# EAGLE design TSOC_Teensy3X (EAGLE 6.6.0)
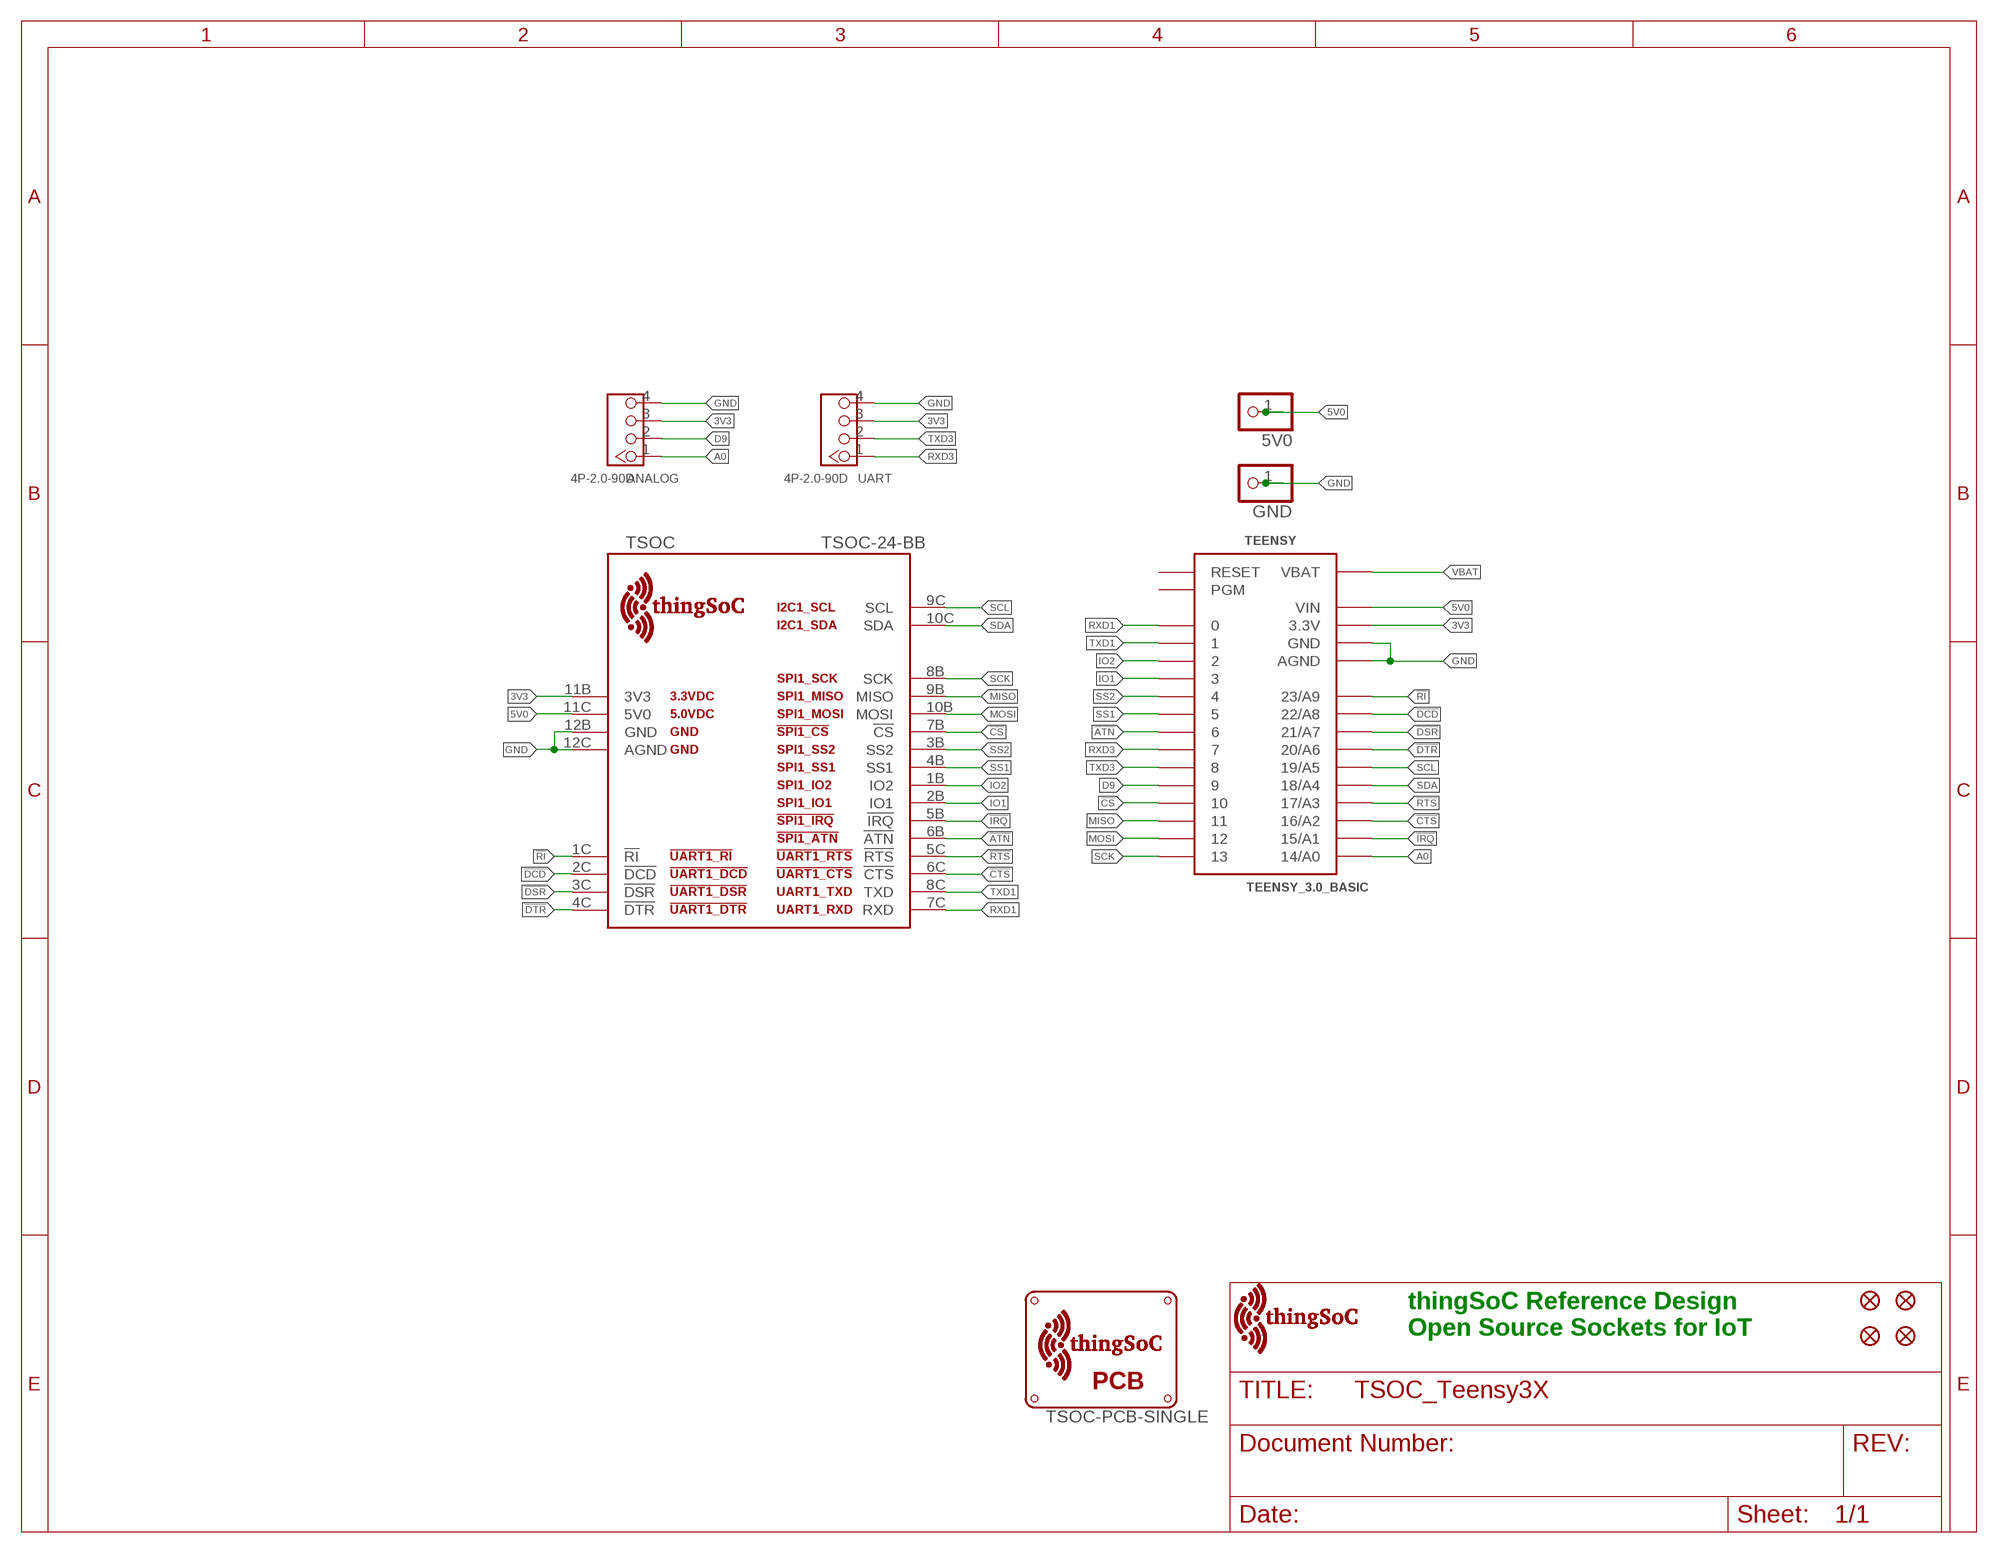
[diagram p0: schematic, sheet 1]

## Parts
5V0  WPAD-1-PTH  [WPAD-1-PTH-2.54]
ANALOG  4P-2.0-90D  GROVE-CONNECTOR-DIP-90D(4P-2.0)  [HW4-2.0-90D]
FID1  FIDUCIALUFIDUCIAL  [MICRO-FIDUCIAL]
FID2  FIDUCIALUFIDUCIAL  [MICRO-FIDUCIAL]
FID3  FIDUCIALUFIDUCIAL  [MICRO-FIDUCIAL]
FID4  FIDUCIALUFIDUCIAL  [MICRO-FIDUCIAL]
GND  WPAD-1-PTH  [WPAD-1-PTH-2.54]
TEENSY  TEENSY_3.0_BASIC  [TEENSY_3.0_BASIC]
TSOC  TSOC-24-BB  [TSOC-BB-S24]
U$2  TSOC-PCB-SINGLE  [TSOC-BB-BRD-DIM]
U$5  TSOC-LOGO-LRG  [TSOC-LOGO-LRG]
UART  4P-2.0-90D  GROVE-CONNECTOR-DIP-90D(4P-2.0)  [HW4-2.0-90D]

## Nets
3V3: ANALOG.3 TEENSY.3.3V TEENSY.3.3V1(3.3V) TSOC.11B(3V3) UART.3
5V0: 5V0.1 TEENSY.VIN TSOC.11C(5V0)
!ATN: TEENSY.6 TSOC.6B(!ATN)
!CS: TEENSY.10 TSOC.7B(!CS)
!CTS: TEENSY.16/A2 TSOC.6C(!CTS)
!DCD: TEENSY.22/A8 TSOC.2C(!DCD)
!DSR: TEENSY.21/A7 TSOC.3C(!DSR)
!DTR: TEENSY.20/A6 TSOC.4C(!DTR)
!IRQ: TEENSY.15/A1 TSOC.5B(!IRQ)
!RI: TEENSY.23/A9 TSOC.1C(!RI)
!RTS: TEENSY.17/A3 TSOC.5C(!RTS)
A0: ANALOG.1 TEENSY.14/A0
D9: ANALOG.2 TEENSY.9
GND: ANALOG.4 GND.1 TEENSY.AGND TEENSY.GND TEENSY.GND1(GND) TSOC.12B(GND) TSOC.12C(AGND) UART.4
IO1: TEENSY.3 TSOC.2B(IO1)
IO2: TEENSY.2 TSOC.1B(IO2)
MISO: TEENSY.11 TSOC.9B(MISO)
MOSI: TEENSY.12 TSOC.10B(MOSI)
RXD1: TEENSY.0 TSOC.7C(RXD)
RXD3: TEENSY.7 UART.1
SCK: TEENSY.13 TSOC.8B(SCK)
SCL: TEENSY.19/A5 TSOC.9C(SCL)
SDA: TEENSY.18/A4 TSOC.10C(SDA)
SS1: TEENSY.5 TSOC.4B(SS1)
SS2: TEENSY.4 TSOC.3B(SS2)
TXD1: TEENSY.1 TSOC.8C(TXD)
TXD3: TEENSY.8 UART.2
VBAT: TEENSY.VBAT
Unconnected: TEENSY.PGM TEENSY.RESET

## Notes on the sheet
- thingSoC Reference Design
  Open Source Sockets for IoT

## Library data of the parts
5V0 GND = PatternAgents-ProtoPads:WPAD-1: Wire Pad - Single Good for scope lead clips, test jumpers, probe points, etc. PatternAgents ProtoPads Library Schematic and PCB layout libraries for design patterns by PatternAgents. For the CADSoft Eagle CAD program : http://www.cadsoftusa.com/download-eagle/ Source LBR : http://www.patternagents.com Github : https://github.com/PatternAgents License : http://creativecommons.org/licenses/by-sa/4.0/ (Creative Commons 4.0) THIS SOFTWARE IS PROVIDED BY THE CONTRIBUTORS "AS IS" AND WITHOUT ANY EXPRESS OR IMPLIED WARRANTIES, INCLUDING, BUT NOT LIMITED TO, THE IMPLIED WARRANTIES OF MERCHANTABILITY AND FITNESS FOR A PARTICULAR PURPOSE ARE DISCLAIMED. IN NO EVENT SHALL THE COPYRIGHT OWNER OR CONTRIBUTORS BE LIABLE FOR ANY DIRECT, INDIRECT, INCIDENTAL, SPECIAL, EXEMPLARY, OR CONSEQUENTIAL DAMAGES (INCLUDING, BUT NOT LIMITED TO, PROCUREMENT OF SUBSTITUTE GOODS OR SERVICES; LOSS OF USE, DATA, OR PROFITS; OR BUSINESS INTERRUPTION) HOWEVER CAUSED AND ON ANY THEORY OF LIABILITY, WHETHER IN CONTRACT, STRICT LIABILITY, OR TORT (INCLUDING NEGLIGENCE OR OTHERWISE) ARISING IN ANY WAY OUT OF THE USE OF THIS SOFTWARE, EVEN IF ADVISED OF THE POSSIBILITY OF SUCH DAMAGE.; BOM: EXCLUDE
ANALOG UART = Seeed-Connector -2016:GROVE-CONNECTOR-DIP-90D(4P-2.0): 320110034
FID1-FID4 = TSOC-ESP8266-BASE:FIDUCIAL: Fiducial Alignment Points Various fiducial points for machine vision alignment.
TEENSY = Teensy3.0:TEENSY_3.0_BASIC: Basic Teensy 3.0 with none of the 'inner' pins enabled. See '+4', 'AllAnalogPins", and 'AllPins' packages for additional pin holes, as needed.
TSOC = thingSoC:TSOC-24: thingSoC Twenty-Four(24) Pin Socket Source LBR : http://www.thingsoc.com Github : https://github.com/thingsoc License : http://creativecommons.org/licenses/by-sa/4.0/ (Creative Commons 4.0) THIS SOFTWARE IS PROVIDED BY THE CONTRIBUTORS "AS IS" AND WITHOUT ANY EXPRESS OR IMPLIED WARRANTIES, INCLUDING, BUT NOT LIMITED TO, THE IMPLIED WARRANTIES OF MERCHANTABILITY AND FITNESS FOR A PARTICULAR PURPOSE ARE DISCLAIMED. IN NO EVENT SHALL THE COPYRIGHT OWNER OR CONTRIBUTORS BE LIABLE FOR ANY DIRECT, INDIRECT, INCIDENTAL, SPECIAL, EXEMPLARY, OR CONSEQUENTIAL DAMAGES (INCLUDING, BUT NOT LIMITED TO, PROCUREMENT OF SUBSTITUTE GOODS OR SERVICES; LOSS OF USE, DATA, OR PROFITS; OR BUSINESS INTERRUPTION) HOWEVER CAUSED AND ON ANY THEORY OF LIABILITY, WHETHER IN CONTRACT, STRICT LIABILITY, OR TORT (INCLUDING NEGLIGENCE OR OTHERWISE) ARISING IN ANY WAY OUT OF THE USE OF THIS SOFTWARE, EVEN IF ADVISED OF THE POSSIBILITY OF SUCH DAMAGE.
U$2 = thingSoC:TSOC-PCB: thingSoC PCB Outlines Boards Outlines for Standard Sizes (in the DImension Layer) (Registration marks in the tDocu layer - make sure to turn on tDocu/bDocu) Source LBR : http://www.thingsoc.com Github : https://github.com/thingsoc License : http://creativecommons.org/licenses/by-sa/4.0/ (Creative Commons 4.0) THIS SOFTWARE IS PROVIDED BY THE CONTRIBUTORS "AS IS" AND WITHOUT ANY EXPRESS OR IMPLIED WARRANTIES, INCLUDING, BUT NOT LIMITED TO, THE IMPLIED WARRANTIES OF MERCHANTABILITY AND FITNESS FOR A PARTICULAR PURPOSE ARE DISCLAIMED. IN NO EVENT SHALL THE COPYRIGHT OWNER OR CONTRIBUTORS BE LIABLE FOR ANY DIRECT, INDIRECT, INCIDENTAL, SPECIAL, EXEMPLARY, OR CONSEQUENTIAL DAMAGES (INCLUDING, BUT NOT LIMITED TO, PROCUREMENT OF SUBSTITUTE GOODS OR SERVICES; LOSS OF USE, DATA, OR PROFITS; OR BUSINESS INTERRUPTION) HOWEVER CAUSED AND ON ANY THEORY OF LIABILITY, WHETHER IN CONTRACT, STRICT LIABILITY, OR TORT (INCLUDING NEGLIGENCE OR OTHERWISE) ARISING IN ANY WAY OUT OF THE USE OF THIS SOFTWARE, EVEN IF ADVISED OF THE POSSIBILITY OF SUCH DAMAGE.
U$5 = thingSoC:TSOC-LOGO: thingSoC Logo Source LBR : http://www.thingsoc.com Github : https://github.com/thingsoc License : http://creativecommons.org/licenses/by-sa/4.0/ (Creative Commons 4.0) THIS SOFTWARE IS PROVIDED BY THE CONTRIBUTORS "AS IS" AND WITHOUT ANY EXPRESS OR IMPLIED WARRANTIES, INCLUDING, BUT NOT LIMITED TO, THE IMPLIED WARRANTIES OF MERCHANTABILITY AND FITNESS FOR A PARTICULAR PURPOSE ARE DISCLAIMED. IN NO EVENT SHALL THE COPYRIGHT OWNER OR CONTRIBUTORS BE LIABLE FOR ANY DIRECT, INDIRECT, INCIDENTAL, SPECIAL, EXEMPLARY, OR CONSEQUENTIAL DAMAGES (INCLUDING, BUT NOT LIMITED TO, PROCUREMENT OF SUBSTITUTE GOODS OR SERVICES; LOSS OF USE, DATA, OR PROFITS; OR BUSINESS INTERRUPTION) HOWEVER CAUSED AND ON ANY THEORY OF LIABILITY, WHETHER IN CONTRACT, STRICT LIABILITY, OR TORT (INCLUDING NEGLIGENCE OR OTHERWISE) ARISING IN ANY WAY OUT OF THE USE OF THIS SOFTWARE, EVEN IF ADVISED OF THE POSSIBILITY OF SUCH DAMAGE.

## Net classes
1 vcc: width 0.254 mm

## Board
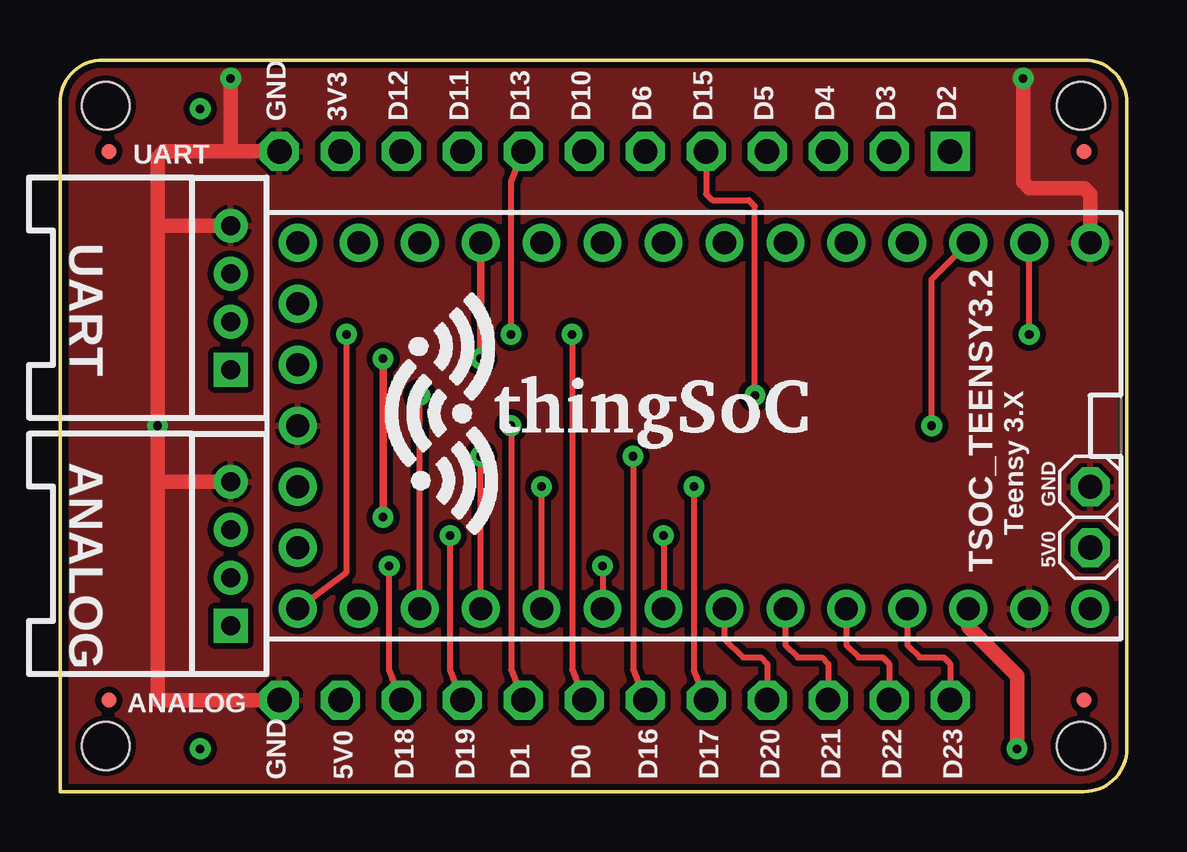
[diagram p1: board, top side]
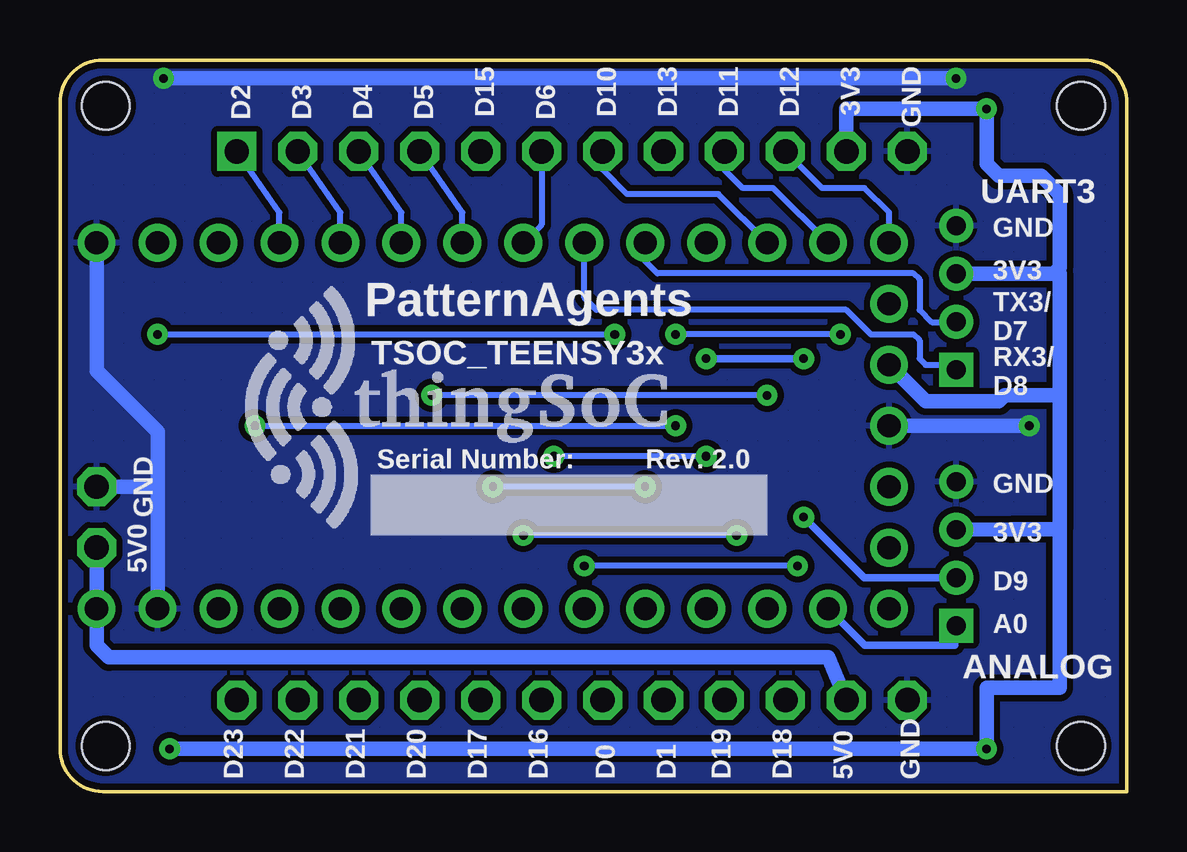
[diagram p2: board, bottom side, seen from below]

Size 44.45 x 30.48 mm. Coordinates in mm from the lower left corner, seen from the top.
Copper layers (1*16): Top 0.035mm / dielectric 1.5mm / Bottom 0.035mm
Design rules "PatternAgents_7mil": minimum track width 7mil, minimum drill 14mil, track to track 7mil, track to pad 7mil, pad to pad 7mil, via to via 7mil, smd to smd 7mil, copper to edge 7mil, drill to drill 7mil, minimum pad ring 12mil, minimum via ring 10mil, stop-mask expansion 4mil, vias tented up to drill 25mil, thermal gap 7mil

### Footprints (pad centres in the part's own frame; a part is rotated, then mirrored left to right if it is on the bottom)
WPAD-1-PTH-2.54 = drill 1.016 octagon: 1 0,0
HW4-2.0-90D = drill 0.8 pad 1.27 square: 1 -3,0 | drill 0.8 pad 1.27: 2 -1,0; 3 1,0; 4 3,0
MICRO-FIDUCIAL = smd 0.635 x 0.635: 1 0,0
TEENSY_3.0_BASIC = drill 0.965: 0 -7.62,13.97; 1 -7.62,11.43; 2 -7.62,8.89; 3 -7.62,6.35; 3.3V 7.62,11.43; 3.3V1 -2.54,-16.51; 4 -7.62,3.81; 5 -7.62,1.27; 6 -7.62,-1.27; 7 -7.62,-3.81; 8 -7.62,-6.35; 9 -7.62,-8.89; 10 -7.62,-11.43; 11 -7.62,-13.97; 12 -7.62,-16.51; 13 7.62,-16.51; 14/A0 7.62,-13.97; 15/A1 7.62,-11.43; 16/A2 7.62,-8.89; 17/A3 7.62,-6.35; 18/A4 7.62,-3.81; 19/A5 7.62,-1.27; 20/A6 7.62,1.27; 21/A7 7.62,3.81; 22/A8 7.62,6.35; 23/A9 7.62,8.89; AGND 7.62,13.97; GND -7.62,16.51; GND1 0,-16.51; PGM 2.54,-16.51; RESET 5.08,-16.51; VBAT -5.08,-16.51; VIN 7.62,16.51
TSOC-BB-S24 = drill 1.016 square: 1B -11.43,11.43 | drill 1.016 octagon: 1C 11.43,11.43; 2B -11.43,8.89; 2C 11.43,8.89; 3B -11.43,6.35; 3C 11.43,6.35; 4B -11.43,3.81; 4C 11.43,3.81; 5B -11.43,1.27; 5C 11.43,1.27; 6B -11.43,-1.27; 6C 11.43,-1.27; 7B -11.43,-3.81; 7C 11.43,-3.81; 8B -11.43,-6.35; 8C 11.43,-6.35; 9B -11.43,-8.89; 9C 11.43,-8.89; 10B -11.43,-11.43; 10C 11.43,-11.43; 11B -11.43,-13.97; 11C 11.43,-13.97; 12B -11.43,-16.51; 12C 11.43,-16.51
TSOC-BB-BRD-DIM = hole 2: 13.335,16.891; -13.335,16.891; 13.335,-23.749; -13.335,-23.749

### Placement (x,y rotation side)
5V0  42.93,10.16 90 top
ANALOG  7.11,9.91 90 top
FID1  2.03,3.81 0 top
FID2  42.67,3.81 0 top
FID3  2.03,26.67 0 top
FID4  42.67,26.67 0 top
GND  42.93,12.7 90 top
TEENSY  26.42,15.24 270 top
TSOC  25.65,15.24 270 top
U$1  TSOC-LOGO-LRG  [TSOC-LOGO-LRG]  33.53,16 0 bottom
U$2  25.65,15.24 270 top
U$5  16.76,15.75 0 top
UART  7.11,20.57 90 top

### Tracks (layer width: path | path; a pad name or v marks a point on that pad's centre or on a via)
3V3  (via drill 0.36)
  Top 0.61: TEENSY.3.3V 37.85,6.86 39.88,4.83 v39.88,1.78
  Bottom 0.61: TSOC.11B 11.68,28.45 v5.84,28.45 5.84,26.16 5.33,25.65 3.56,25.65 2.79,24.89 2.79,21.83 3.05,21.57 | v39.88,1.78 v5.84,1.78 5.84,4.32 2.79,4.32 2.79,10.92 | UART.3 3.05,21.57 | 3.05,21.57 2.81,21.57 2.79,21.59 2.79,16.51 | 2.79,16.51 2.79,10.92 | 2.79,10.92 4.81,10.92 ANALOG.3 | 2.79,16.51 5.08,16.51 5.33,16.26 8.38,16.26 TEENSY.3.3V1
5V0
  Bottom 0.61: TSOC.11C 12.45,5.59 42.42,5.59 42.93,6.1 TEENSY.VIN 5V0.1
!ATN
  Bottom 0.254: TSOC.6B 24.38,23.62 TEENSY.6
!CS
  Bottom 0.254: TEENSY.10 17.02,24.89 20.83,24.89 21.84,25.91 TSOC.7B
!CTS  (via drill 0.36)
  Top 0.254: TEENSY.16/A2 v17.53,13.97 | v23.88,13.97 23.88,5.08 TSOC.6C
  Bottom 0.254: v17.53,13.97 v23.88,13.97
!DCD
  Top 0.254: TEENSY.22/A8 32.77,6.1 33.27,5.59 34.29,5.59 34.54,5.33 TSOC.2C
!DSR
  Top 0.254: TEENSY.21/A7 30.23,6.1 30.73,5.59 31.75,5.59 32,5.33 TSOC.3C
!DTR
  Top 0.254: TEENSY.20/A6 27.69,6.35 28.45,5.59 29.21,5.59 29.46,5.33 TSOC.4C
!IRQ  (via drill 0.36)
  Top 0.254: TEENSY.15/A1 v14.99,16.51 | v28.96,16.51 28.96,24.38 28.7,24.64 27.18,24.64 26.92,24.89 TSOC.5B
  Bottom 0.254: v14.99,16.51 v28.96,16.51
!RI
  Top 0.254: TEENSY.23/A9 35.31,6.1 35.81,5.59 36.83,5.59 37.08,5.33 TSOC.1C
!RTS  (via drill 0.36)
  Top 0.254: TSOC.5C 26.42,5.08 v26.42,12.7 | TEENSY.17/A3 v20.07,12.7
  Bottom 0.254: v20.07,12.7 v26.42,12.7
A0
  Bottom 0.305: TEENSY.14/A0 10.92,6.1 7.16,6.1 ANALOG.1
D9  (via drill 0.36)
  Top 0.305: v13.46,11.43 v13.46,18.03 | v17.53,18.03 TEENSY.9
  Bottom 0.305: v13.46,18.03 v17.53,18.03 | ANALOG.2 10.94,8.91 v13.46,11.43
GND  (via drill 0.36)
  Top 0.61: TSOC.12B 7.11,26.67 | TEENSY.GND 42.93,24.89 42.67,25.15 40.39,25.15 40.13,25.4 v40.13,29.72 | v7.11,29.72 7.11,26.67 | 4.06,12.95 v4.06,15.24 4.06,23.62 | 4.06,12.95 4.06,3.81 TSOC.12C | ANALOG.4 4.11,12.91 4.06,12.95 | 4.06,23.62 4.06,26.42 4.32,26.67 7.11,26.67 | UART.4 4.11,23.57 4.06,23.62
  Bottom 0.61: v7.11,29.72 v40.13,29.72 | TEENSY.AGND 40.39,12.7 | 40.39,12.7 40.39,14.99 42.93,17.53 TEENSY.GND | GND.1 40.39,12.7 | TEENSY.GND1 v4.06,15.24
  pour Top (isolate 0.254, hatched): 44.45,29.21 44.45,1.83 arc-90 42.62,0 0,0 0,29.21 1.02,30.48 43.18,30.48
  pour Bottom (isolate 0.254, hatched): 44.45,29.21 44.45,1.83 arc-90 42.62,0 0,0 0,29.21 1.02,30.48 43.18,30.48
IO1
  Bottom 0.254: TEENSY.3 32.77,24.13 TSOC.2B
IO2
  Bottom 0.254: TEENSY.2 35.31,24.13 TSOC.1B
MISO
  Bottom 0.254: TEENSY.11 14.73,25.15 16,25.15 16.76,25.91 TSOC.9B
MOSI
  Bottom 0.254: TEENSY.12 9.91,24.13 10.92,25.15 12.7,25.15 TSOC.10B
RXD1  (via drill 0.36)
  Top 0.254: v21.34,19.05 21.34,5.08 TSOC.7C | v40.39,19.05 TEENSY.0
  Bottom 0.254: v40.39,19.05 v21.34,19.05
RXD3
  Bottom 0.254: TEENSY.7 22.61,20.57 22.1,20.07 11.68,20.07 10.67,19.05 8.89,19.05 8.64,18.8 8.64,18.03 8.38,17.78 7.32,17.78 UART.1
SCK  (via drill 0.36)
  Top 0.254: v18.8,19.05 18.8,25.4 TSOC.8B | TEENSY.13 11.94,9.14 v11.94,19.05
  Bottom 0.254: v11.94,19.05 v18.8,19.05
SCL  (via drill 0.36)
  Top 0.254: TSOC.9C 16.26,5.08 v16.26,10.67 | v25.15,10.67 TEENSY.19/A5
  Bottom 0.254: v16.26,10.67 v25.15,10.67
SDA  (via drill 0.36)
  Top 0.254: TSOC.10C 13.72,5.08 v13.72,9.4 | v22.61,9.4 TEENSY.18/A4
  Bottom 0.254: v13.72,9.4 v22.61,9.4
SS1
  Bottom 0.254: TEENSY.5 27.69,24.13 TSOC.4B
SS2
  Bottom 0.254: TEENSY.4 30.23,24.13 TSOC.3B
TXD1  (via drill 0.36)
  Top 0.254: v18.8,15.24 18.8,5.08 TSOC.8C | v36.32,15.24 36.32,21.34 TEENSY.1
  Bottom 0.254: v36.32,15.24 v18.8,15.24
TXD3
  Bottom 0.254: TEENSY.8 20.07,22.1 19.56,21.59 8.89,21.59 8.64,21.34 8.64,20.07 8.13,19.56 7.13,19.56 UART.2

### Text on the board
tPlace: GND | 3V3 | D12 | D11 | D13 | D10 | D6 | D15 | D5 | D4 | D3 | D2 | UART | ANALOG | Teensy 3.X | TSOC_TEENSY3.2 | GND | 5V0 | D18 | D19 | D1 | D0 | D16 | D17 | D20 | D21 | D22 | D23
bPlace: GND | 3V3 | D12 | D11 | D13 | D10 | D15 | D6 | D5 | D4 | D3 | D2 | UART3 | GND | 3V3 | PatternAgents | TX3/ / D7 | TSOC_TEENSY3x | RX3/ / D8 | GND | Rev. 2.0 | Serial Number: | GND | 5V0 | 3V3 | D9 | A0 | ANALOG | GND | 5V0 | D18 | D19 | D1 | D0 | D16 | D17 | D20 | D21 | D22 | D23